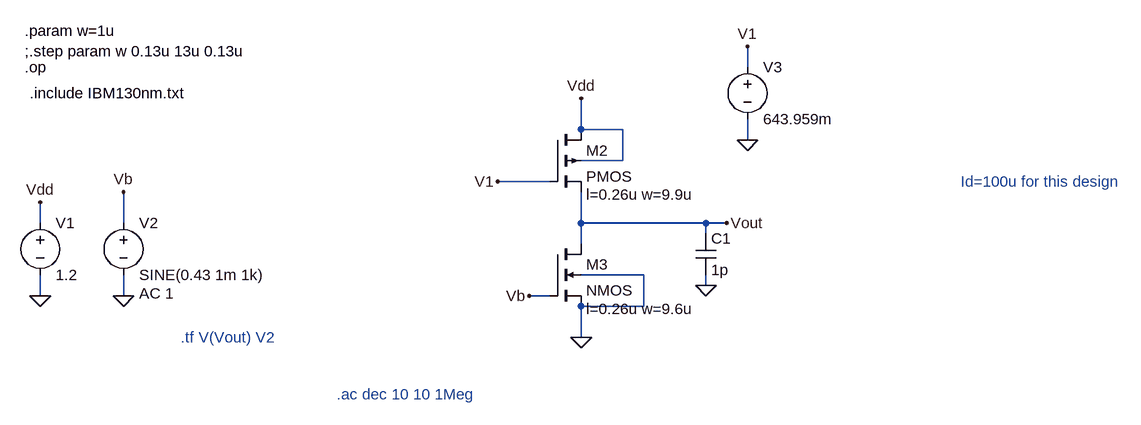
[diagram p0: schematic SingleStageCS.asc]
SingleStageCS.asc, the LTspice schematic file:
Version 4
SHEET 1 1664 680
WIRE 1056 32 1056 0
WIRE 800 128 800 80
WIRE 864 128 800 128
WIRE 1056 144 1056 112
WIRE 864 176 864 128
WIRE 864 176 800 176
WIRE 752 208 672 208
WIRE -32 272 -32 240
WIRE 96 272 96 224
WIRE 800 272 800 224
WIRE 992 272 800 272
WIRE 1024 272 992 272
WIRE 992 288 992 272
WIRE 800 304 800 272
WIRE 896 352 800 352
WIRE 992 368 992 352
WIRE -32 384 -32 352
WIRE 96 384 96 352
WIRE 752 384 720 384
WIRE 896 400 896 352
WIRE 896 400 800 400
WIRE 800 448 800 400
FLAG -32 384 0
FLAG -32 240 Vdd
FLAG 800 448 0
FLAG 992 368 0
FLAG 96 384 0
FLAG 96 224 Vb
FLAG 720 384 Vb
FLAG 1024 272 Vout
FLAG 1056 144 0
FLAG 1056 0 V1
FLAG 672 208 V1
FLAG 800 80 Vdd
DATAFLAG 1008 272 ""
SYMBOL voltage -32 256 R0
WINDOW 123 0 0 Left 0
WINDOW 39 0 0 Left 0
SYMATTR InstName V1
SYMATTR Value 1.2
SYMBOL pmos4 752 128 R0
WINDOW 123 56 100 Left 2
SYMATTR InstName M2
SYMATTR Value2 l=0.26u w=9.9u
SYMBOL nmos4 752 304 R0
WINDOW 123 56 100 Left 2
SYMATTR InstName M3
SYMATTR Value2 l=0.26u w=9.6u
SYMBOL cap 976 288 R0
SYMATTR InstName C1
SYMATTR Value 1p
SYMBOL voltage 96 256 R0
WINDOW 123 24 124 Left 2
WINDOW 39 0 0 Left 0
SYMATTR InstName V2
SYMATTR Value SINE(0.43 1m 1k)
SYMATTR Value2 AC 1
SYMBOL voltage 1056 16 R0
WINDOW 123 0 0 Left 0
WINDOW 39 0 0 Left 0
SYMATTR InstName V3
SYMATTR Value 643.959m
TEXT -48 72 Left 2 !.include IBM130nm.txt
TEXT -56 -24 Left 2 !.param w=1u\n;.step param w 0.13u 13u 0.13u
TEXT 184 448 Left 2 ;.tf V(Vout) V2
TEXT 424 536 Left 2 ;.ac dec 10 10 1Meg
TEXT -56 32 Left 2 !.op
TEXT 1384 208 Left 2 ;Id=100u for this design

The netlist it stands for:
* SingleStageCS.asc
V1 Vdd 0 1.2
M2 Vdd V1 Vout Vdd PMOS l=0.26u w=9.9u
M3 Vout Vb 0 0 NMOS l=0.26u w=9.6u
C1 Vout 0 1p
V2 Vb 0 SINE(0.43 1m 1k) AC 1
V3 V1 0 643.959m
.model NMOS NMOS
.model PMOS PMOS
.lib standard.mos
.include IBM130nm.txt
.param w=1u
;.step param w 0.13u 13u 0.13u
* .tf V(Vout) V2
* .ac dec 10 10 1Meg
.op
* Id=100u for this design
.backanno
.end